# EAGLE design IR7 (EAGLE 7.6.0)
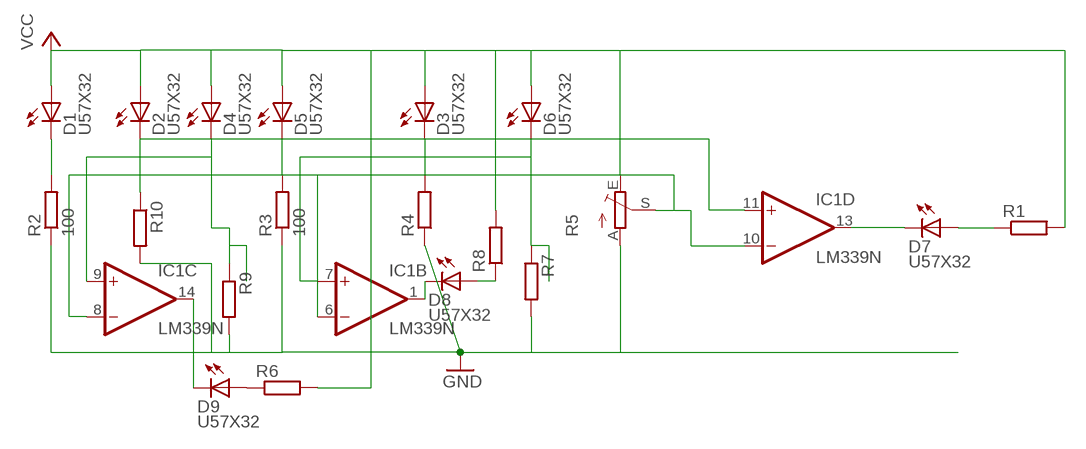
[diagram p0: schematic, sheet 1]

## Parts
D1  U57X32  [U57X32]
D2  U57X32  [U57X32]
D3  U57X32  [U57X32]
D4  U57X32  [U57X32]
D5  U57X32  [U57X32]
D6  U57X32  [U57X32]
D7  U57X32  [U57X32]
D8  U57X32  [U57X32]
D9  U57X32  [U57X32]
IC1  LM339N  [DIL14]
R1  R-EU_0204/7  [0204/7]
R2  100  R-EU_0204/7  [0204/7]
R3  100  R-EU_0204/7  [0204/7]
R4  R-EU_0204/7  [0204/7]
R5  TRIM_1234-S64YW  [S64YW]
R6  R-EU_0204/7  [0204/7]
R7  R-EU_0204/7  [0204/7]
R8  R-EU_0204/7  [0204/7]
R9  R-EU_0204/7  [0204/7]
R10  R-EU_0204/7  [0204/7]

## Nets
GND: R2.1 R3.1 R4.1 R5.A R7.2 R9.2 R10.2
N$1: D1.K(C) R2.2
N$2: D5.K(C) R3.2
N$3: D3.K(C) R4.2
N$4: D8.A R8.1
N$5: D9.A R6.1
N$7: D7.K(C) IC1.13(D:OUT)
N$8: D7.A R1.1
N$9: IC1.6(B:-IN) IC1.8(C:-IN) IC1.10(D:-IN) R5.S
N$10: D6.K(C) IC1.7(B:+IN) R7.1
N$11: D4.K(C) IC1.9(C:+IN) R9.1
N$12: D2.K(C) IC1.11(D:+IN) R10.1
N$13: D9.K(C) IC1.14(C:OUT)
N$16: D8.K(C) IC1.1(B:OUT)
VCC: D1.A D2.A D3.A D4.A D5.A D6.A R1.2 R5.E R6.2 R8.2
Unconnected: IC1.2(A:OUT) IC1.4(A:-IN) IC1.5(A:+IN) R5.S@1(S)

## Power pins joined to a net without a drawn wire
GND: IC1.12(P:GND)
VCC: IC1.3(P:V+)

## Library data of the parts
D1-D9 = led:U57X32: LED rectangle, 5.7 x 3.2 mm
IC1 = linear:LM339: Low Power Low Offset Voltage Quad Comparators with open collector; LM139/LM239/LM339/LM2901/LM3302
R1-R4 R6-R10 = rcl:R-EU_: RESISTOR, European symbol
R5 = pot:TRIM_1234-: POTENTIOMETER

## Board
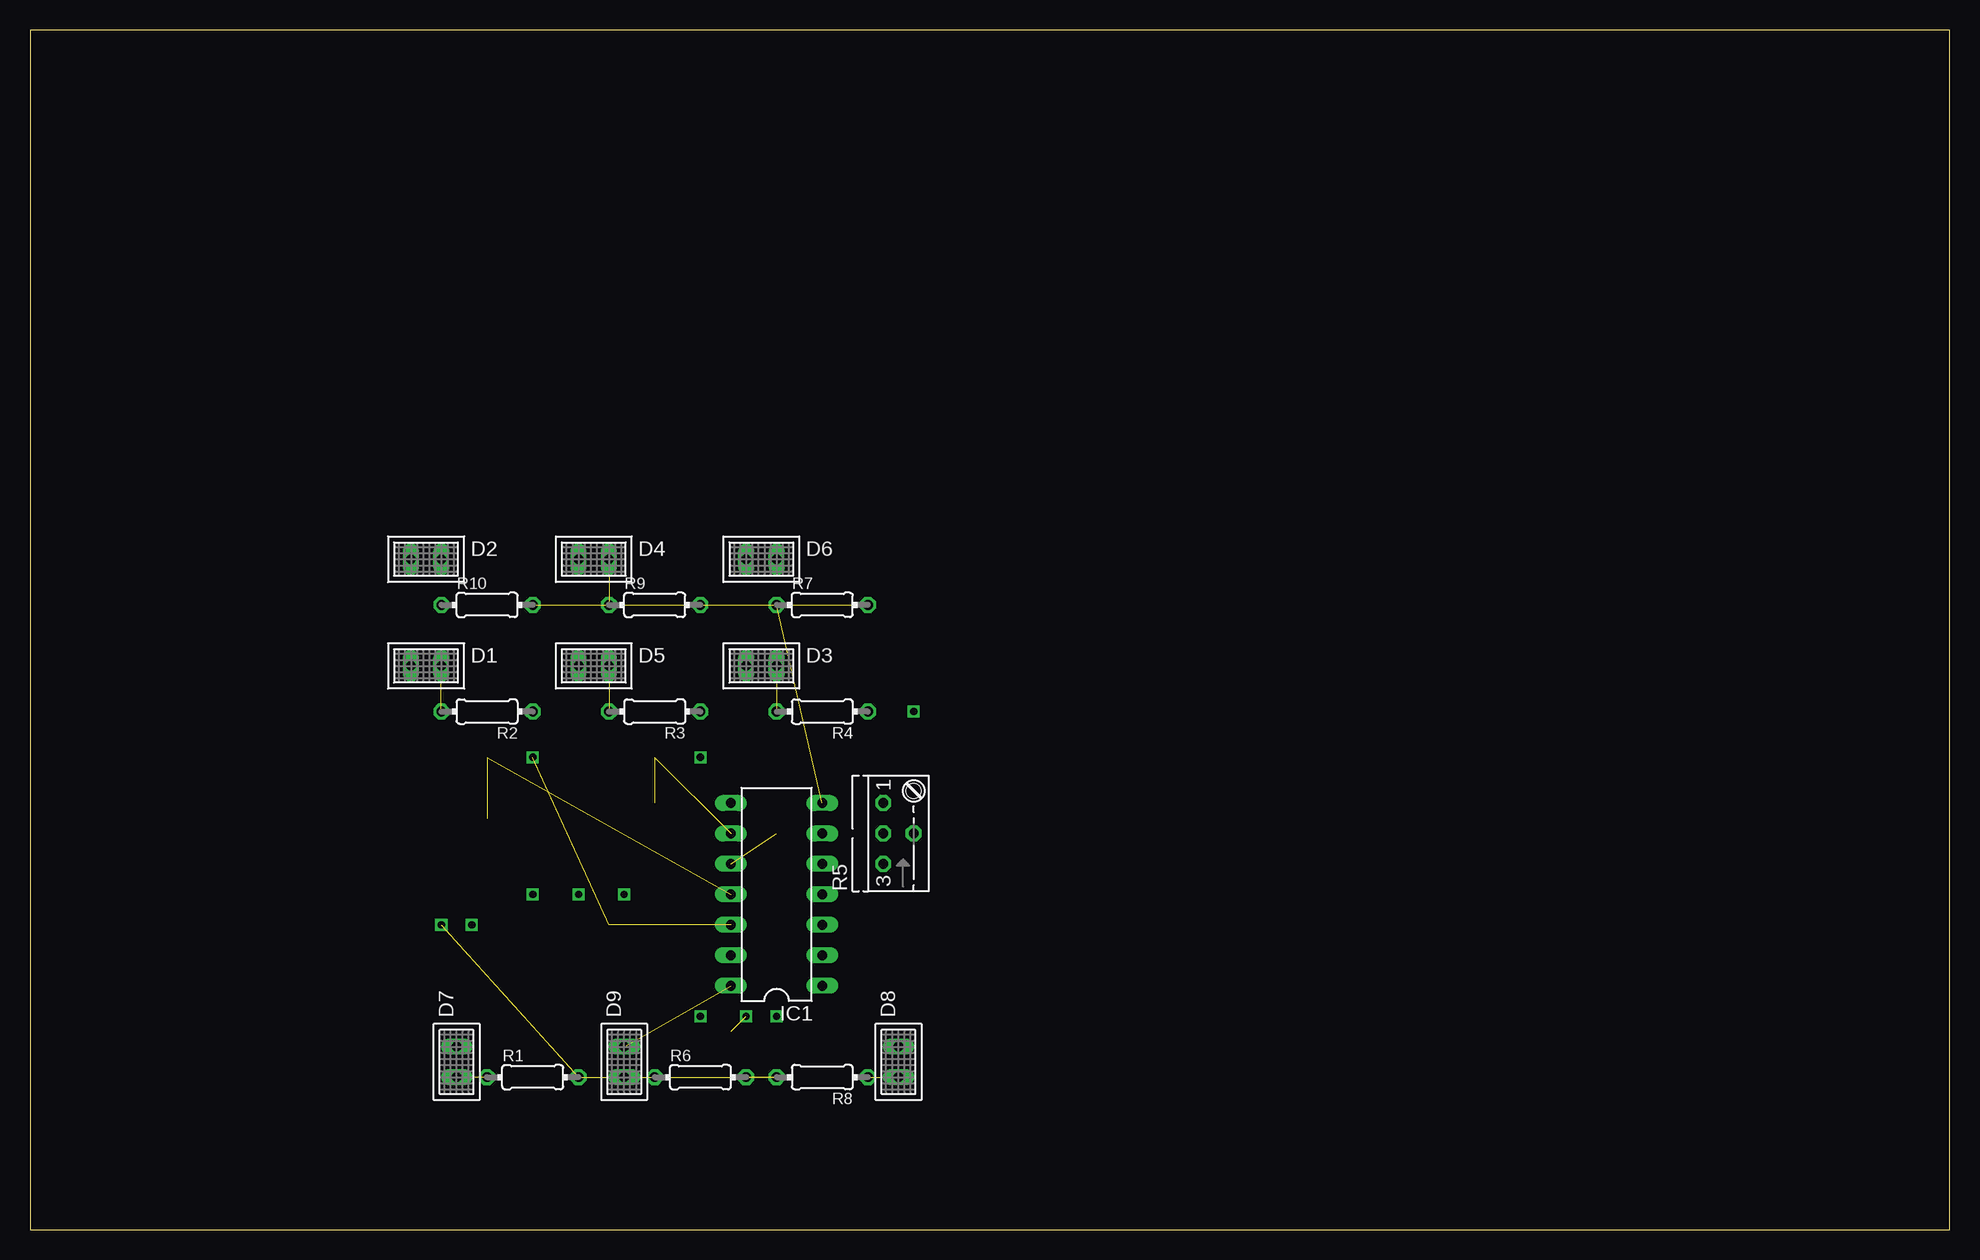
[diagram p1: board, top side]
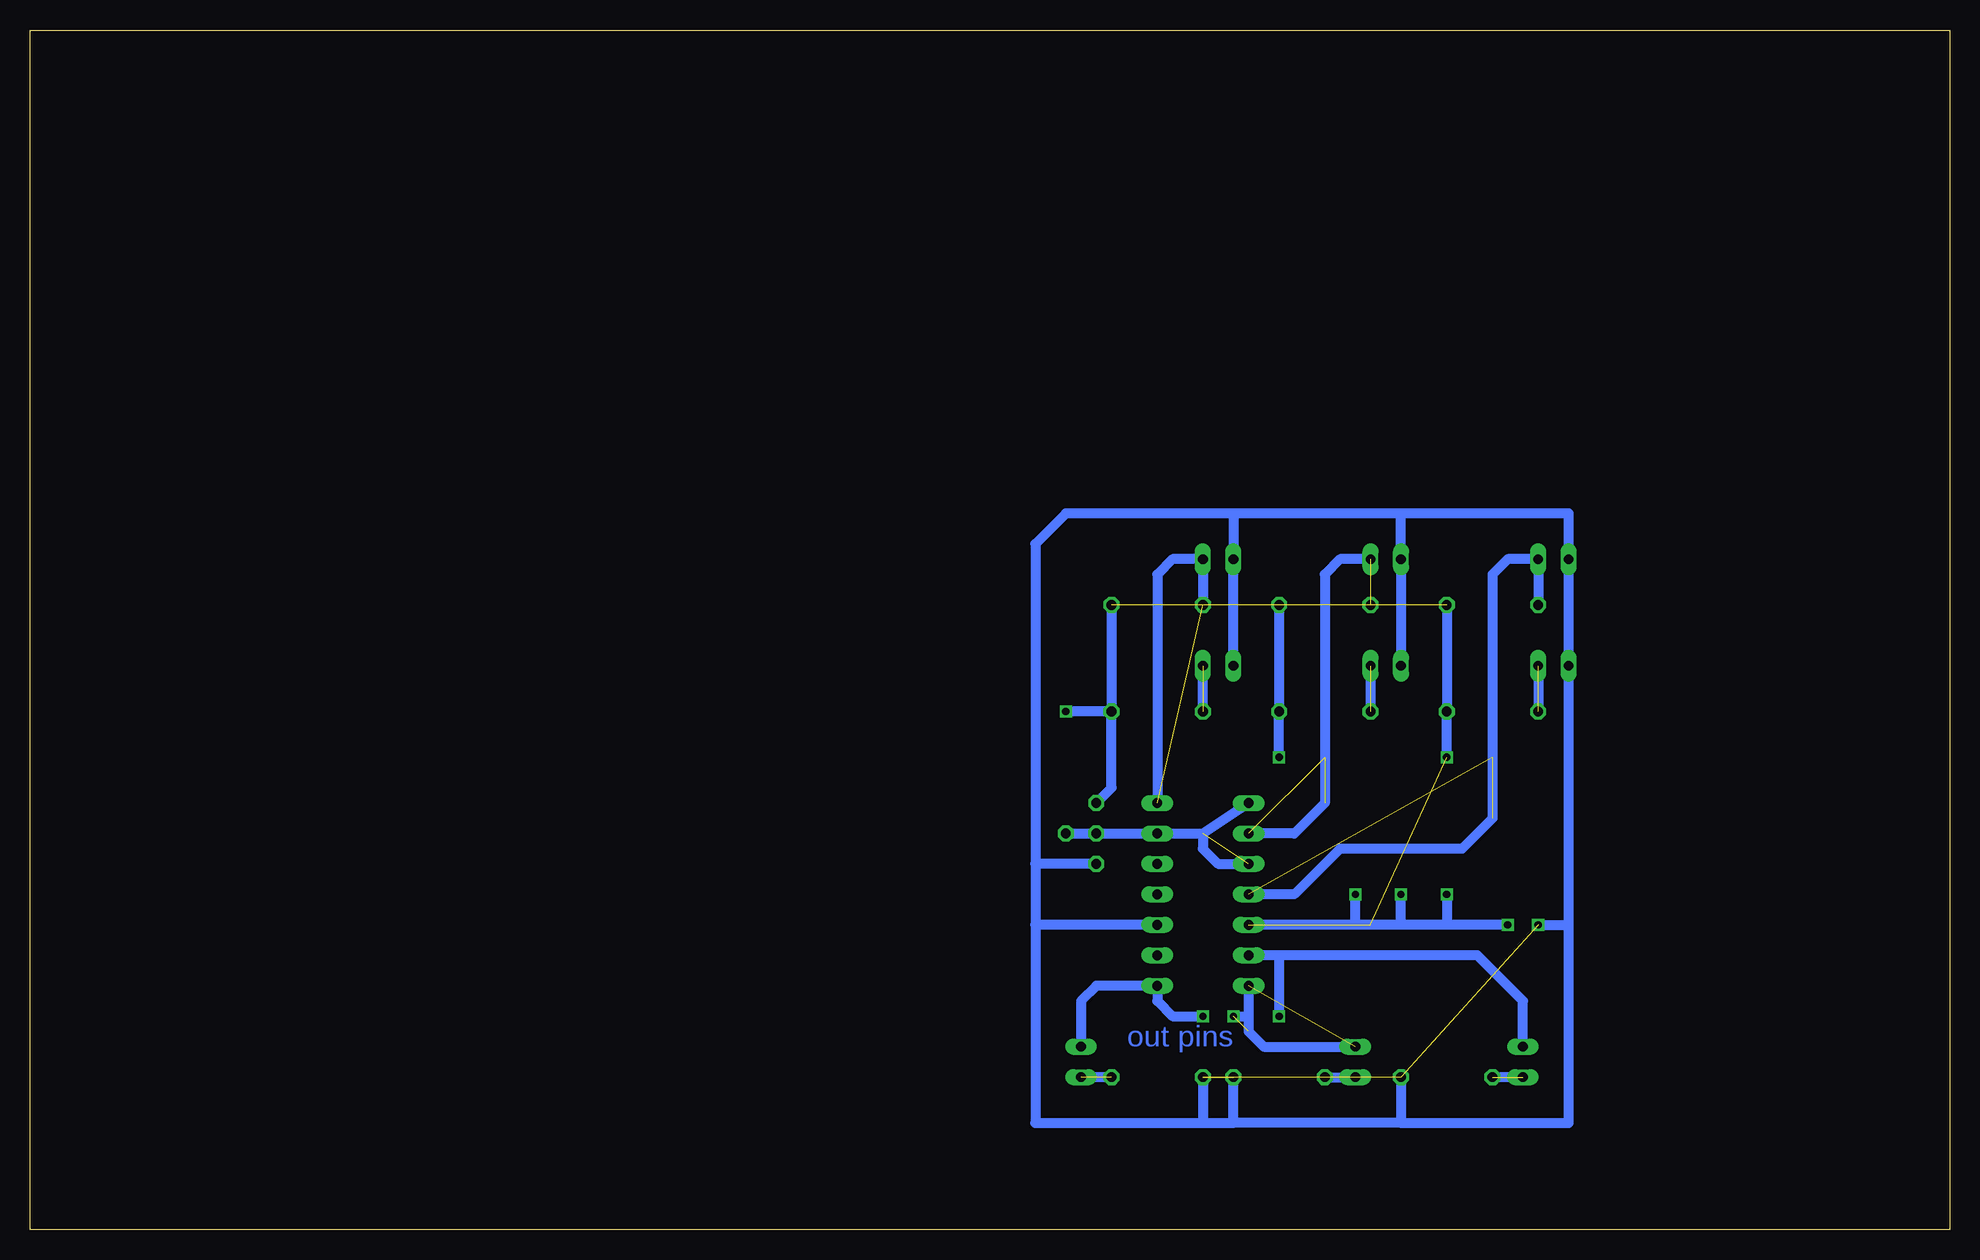
[diagram p2: board, bottom side, seen from below]

Size 160 x 100 mm. Coordinates in mm from the lower left corner, seen from the top.
Outline: 0,0 160,0 160,100 0,100 0,0
Copper layers (1*16): Top 0.035mm / dielectric 1.5mm / Bottom 0.035mm
Design rules "default": minimum track width 10mil, minimum drill 24mil, track to track 8mil, track to pad 8mil, pad to pad 8mil, via to via 8mil, smd to smd 8mil, copper to edge 40mil, drill to drill 8mil, minimum pad ring 10mil, minimum via ring 8mil, stop-mask expansion 4mil, vias tented up to drill 0mil, thermal gap 10mil

### Footprints (pad centres in the part's own frame; a part is rotated, then mirrored left to right if it is on the bottom)
U57X32 = drill 0.813 long: A -1.27,0; K 1.27,0
DIL14 = drill 0.813 long: 1 -7.62,-3.81; 2 -5.08,-3.81; 3 -2.54,-3.81; 4 0,-3.81; 5 2.54,-3.81; 6 5.08,-3.81; 7 7.62,-3.81; 8 7.62,3.81; 9 5.08,3.81; 10 2.54,3.81; 11 0,3.81; 12 -2.54,3.81; 13 -5.08,3.81; 14 -7.62,3.81
0204/7 = drill 0.813 octagon: 1 -3.81,0; 2 3.81,0
S64YW = drill 0.813 octagon: A 2.54,1.27; E -2.54,1.27; S 0,-1.27; S@1 0,1.27

### Placement (x,y rotation side)
D1  33.02,46.99 0 top
D2  33.02,55.88 0 top
D3  60.96,46.99 0 top
D4  46.99,55.88 0 top
D5  46.99,46.99 0 top
D6  60.96,55.88 0 top
D7  35.56,13.97 90 top
D8  72.39,13.97 90 top
D9  49.53,13.97 90 top
IC1  62.23,27.94 90 top
R1  41.91,12.7 0 top
R2  38.1,43.18 180 top
R3  52.07,43.18 180 top
R4  66.04,43.18 180 top
R5  72.39,33.02 90 top
R6  55.88,12.7 0 top
R7  66.04,52.07 0 top
R8  66.04,12.7 180 top
R9  52.07,52.07 0 top
R10  38.1,52.07 0 top

### Tracks (layer width: path | path; a pad name or v marks a point on that pad's centre or on a via)
GND  (via drill 0.6)  (4 unrouted)
  Bottom 0.813: R10.2 R2.1 v41.91,39.37 | R7.2 R4.1 | R9.2 R3.1 v55.88,39.37 | R5.A 69.85,36.83 R4.1 | R4.1 v73.66,43.18 | v36.83,25.4 41.91,25.4 | 45.72,25.4 49.53,25.4 | 49.53,25.4 IC1.12 | v41.91,27.94 41.91,25.4 | 41.91,25.4 45.72,25.4 | 45.72,25.4 v45.72,27.94 | 49.53,25.4 v49.53,27.94
N$1  (1 unrouted)
  Bottom 0.813: D1.K R2.2
N$2  (1 unrouted)
  Bottom 0.813: D5.K R3.2
N$3  (1 unrouted)
  Bottom 0.813: R4.2 D3.K
N$4  (1 unrouted)
  Bottom 0.813: R8.1 D8.A
N$5  (1 unrouted)
  Bottom 0.813: R6.1 D9.A
N$7  (via drill 0.6)
  Bottom 0.813: D7.K 35.56,19.05 39.37,22.86 55.88,22.86 | 55.88,22.86 IC1.13 | 55.88,22.86 v55.88,17.78
N$8  (1 unrouted)
  Bottom 0.813: D7.A R1.1
N$9  (1 unrouted)
  Bottom 0.813: 62.23,33.02 IC1.6 R5.S | 62.23,33.02 IC1.8 | 62.23,33.02 62.23,31.75 60.96,30.48 IC1.10
N$10  (1 unrouted)
  Bottom 0.813: R7.1 D6.K 64.77,55.88 66.04,54.61 IC1.7
N$11  (3 unrouted)
  Bottom 0.813: D4.K 50.8,55.88 52.07,54.61 52.07,35.56 54.61,33.02 IC1.9
N$12  (2 unrouted)
  Bottom 0.813: R10.1 D2.K 36.83,55.88 38.1,54.61 38.1,34.29 40.64,31.75 50.8,31.75 54.61,27.94 IC1.11
N$13  (via drill 0.6)  (2 unrouted)
  Bottom 0.813: IC1.14 58.42,17.78 | 58.42,17.78 58.42,16.51 57.15,15.24 D9.K | v59.69,17.78 58.42,17.78
N$16  (via drill 0.6)
  Bottom 0.813: D8.K 72.39,19.05 71.12,20.32 IC1.1 66.04,19.05 64.77,17.78 v62.23,17.78
  other vias: 66.04,20.32
VCC  (via drill 0.6)  (3 unrouted)
  Bottom 0.813: D5.A D4.A 45.72,59.69 | 45.72,59.69 31.75,59.69 D2.A D1.A 31.75,25.4 | 45.72,59.69 59.69,59.69 | 59.69,59.69 D6.A D3.A | 59.69,59.69 73.66,59.69 76.2,57.15 76.2,30.48 | 31.75,25.4 31.75,8.89 45.72,8.89 | 76.2,30.48 76.2,25.4 | 76.2,25.4 76.2,8.89 62.23,8.89 | 62.23,8.89 59.69,8.89 | IC1.3 76.2,25.4 | R5.E 76.2,30.48 | v34.29,25.4 31.75,25.4 | R1.2 45.72,8.89 | 45.72,8.89 59.69,8.89 | 59.69,8.89 R6.2 | R8.2 62.23,8.89

### Text on the board
Bottom: out pins